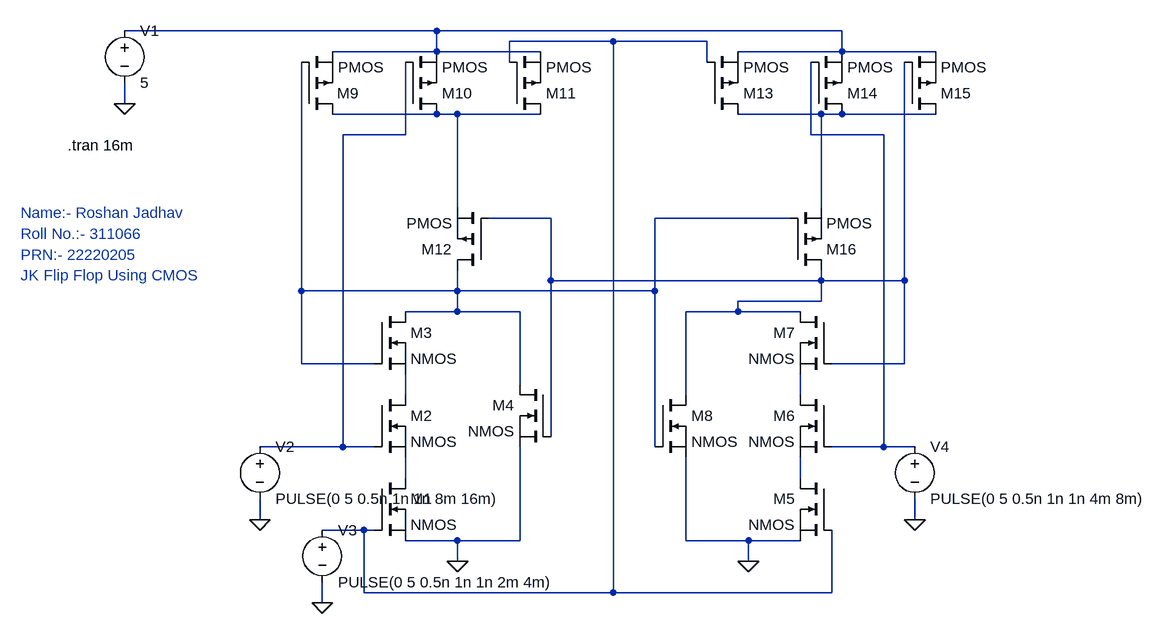
[diagram p0: schematic JK Flip Flop.asc]
JK Flip Flop.asc, the LTspice schematic file:
Version 4
SHEET 1 1160 680
WIRE 48 -400 -432 -400
WIRE 672 -400 48 -400
WIRE 320 -384 160 -384
WIRE 464 -384 320 -384
WIRE 48 -368 48 -400
WIRE 48 -368 -112 -368
WIRE 208 -368 48 -368
WIRE 672 -368 672 -400
WIRE 672 -368 512 -368
WIRE 816 -368 672 -368
WIRE 160 -352 160 -384
WIRE 464 -352 464 -384
WIRE -432 -288 -432 -320
WIRE 48 -272 -112 -272
WIRE 80 -272 48 -272
WIRE 208 -272 80 -272
WIRE 640 -272 512 -272
WIRE 672 -272 640 -272
WIRE 816 -272 672 -272
WIRE 0 -240 0 -352
WIRE 0 -240 -96 -240
WIRE 624 -240 624 -352
WIRE 736 -240 624 -240
WIRE 80 -128 80 -272
WIRE 640 -128 640 -272
WIRE 224 -112 128 -112
WIRE 592 -112 384 -112
WIRE 224 -16 224 -112
WIRE 640 -16 640 -32
WIRE 640 -16 224 -16
WIRE 768 -16 768 -352
WIRE 768 -16 640 -16
WIRE -160 0 -160 -352
WIRE 80 0 80 -32
WIRE 80 0 -160 0
WIRE 384 0 384 -112
WIRE 384 0 80 0
WIRE 640 16 640 -16
WIRE 640 16 512 16
WIRE 80 32 80 0
WIRE 80 32 0 32
WIRE 176 32 80 32
WIRE 512 32 512 16
WIRE 512 32 432 32
WIRE 608 32 512 32
WIRE -160 112 -160 0
WIRE -48 112 -160 112
WIRE 768 112 768 -16
WIRE 768 112 656 112
WIRE 176 144 176 32
WIRE 0 160 0 128
WIRE 432 160 432 32
WIRE 608 160 608 128
WIRE 224 224 224 -16
WIRE -96 240 -96 -240
WIRE -96 240 -224 240
WIRE -48 240 -96 240
WIRE 384 240 384 0
WIRE 736 240 736 -240
WIRE 736 240 656 240
WIRE 784 240 736 240
WIRE 0 288 0 256
WIRE 608 288 608 256
WIRE -224 352 -224 320
WIRE 784 352 784 320
WIRE -64 368 -128 368
WIRE -48 368 -64 368
WIRE 80 384 0 384
WIRE 176 384 176 240
WIRE 176 384 80 384
WIRE 432 384 432 256
WIRE 528 384 432 384
WIRE 608 384 528 384
WIRE 80 416 80 384
WIRE 528 416 528 384
WIRE -64 464 -64 368
WIRE 320 464 320 -384
WIRE 320 464 -64 464
WIRE 656 464 656 368
WIRE 656 464 320 464
WIRE -128 480 -128 448
FLAG 784 352 0
FLAG -128 480 0
FLAG -224 352 0
FLAG -432 -288 0
FLAG 80 416 0
FLAG 528 416 0
SYMBOL nmos -48 288 R0
SYMATTR InstName M1
SYMBOL nmos -48 160 R0
SYMATTR InstName M2
SYMBOL nmos -48 32 R0
SYMATTR InstName M3
SYMBOL nmos 224 144 M0
SYMATTR InstName M4
SYMBOL nmos 656 288 M0
SYMATTR InstName M5
SYMBOL nmos 656 160 M0
SYMATTR InstName M6
SYMBOL nmos 656 32 M0
SYMATTR InstName M7
SYMBOL nmos 384 160 R0
SYMATTR InstName M8
SYMBOL pmos -160 -272 M180
WINDOW 0 55 32 Left 2
SYMATTR InstName M9
SYMBOL pmos 0 -272 M180
SYMATTR InstName M10
SYMBOL pmos 160 -272 M180
SYMATTR InstName M11
SYMBOL pmos 128 -32 R180
SYMATTR InstName M12
SYMBOL pmos 464 -272 M180
SYMATTR InstName M13
SYMBOL pmos 624 -272 M180
SYMATTR InstName M14
SYMBOL pmos 768 -272 M180
SYMATTR InstName M15
SYMBOL pmos 592 -32 M180
SYMATTR InstName M16
SYMBOL voltage -432 -416 R0
WINDOW 123 0 0 Left 0
WINDOW 39 0 0 Left 0
SYMATTR InstName V1
SYMATTR Value 5
SYMBOL voltage -224 224 R0
WINDOW 123 0 0 Left 0
WINDOW 39 0 0 Left 0
SYMATTR InstName V2
SYMATTR Value PULSE(0 5 0.5n 1n 1n 8m 16m)
SYMBOL voltage -128 352 R0
WINDOW 123 0 0 Left 0
WINDOW 39 0 0 Left 0
SYMATTR InstName V3
SYMATTR Value PULSE(0 5 0.5n 1n 1n 2m 4m)
SYMBOL voltage 784 224 R0
WINDOW 123 0 0 Left 0
WINDOW 39 0 0 Left 0
SYMATTR InstName V4
SYMATTR Value PULSE(0 5 0.5n 1n 1n 4m 8m)
TEXT -520 -224 Left 2 !.tran 16m
TEXT -592 -120 Left 2 ;Name:- Roshan Jadhav
TEXT -592 -88 Left 2 ;Roll No.:- 311066
TEXT -592 -56 Left 2 ;PRN:- 22220205
TEXT -592 -24 Left 2 ;JK Flip Flop Using CMOS

The netlist it stands for:
* JK Flip Flop.asc
M1 N011 N002 0 0 NMOS
M2 N009 N005 N011 N011 NMOS
M3 N008 N008 N009 N009 NMOS
M4 N008 N007 0 0 NMOS
M5 N012 N002 0 0 NMOS
M6 N010 N006 N012 N012 NMOS
M7 N007 N007 N010 N010 NMOS
M8 N007 N008 0 0 NMOS
M9 N003 N008 N001 N001 PMOS
M10 N003 N005 N001 N001 PMOS
M11 N003 N002 N001 N001 PMOS
M12 N008 N007 N003 N003 PMOS
M13 N004 N002 N001 N001 PMOS
M14 N004 N006 N001 N001 PMOS
M15 N004 N007 N001 N001 PMOS
M16 N007 N008 N004 N004 PMOS
V1 N001 0 5
V2 N005 0 PULSE(0 5 0.5n 1n 1n 8m 16m)
V3 N002 0 PULSE(0 5 0.5n 1n 1n 2m 4m)
V4 N006 0 PULSE(0 5 0.5n 1n 1n 4m 8m)
.model NMOS NMOS
.model PMOS PMOS
.lib standard.mos
.tran 16m
* Name:- Roshan Jadhav
* Roll No.:- 311066
* PRN:- 22220205
* JK Flip Flop Using CMOS
.backanno
.end